# Altium schematic sheet Charger_USB.SchDoc
size A; SheetNumber: 2; SheetTotal: 4
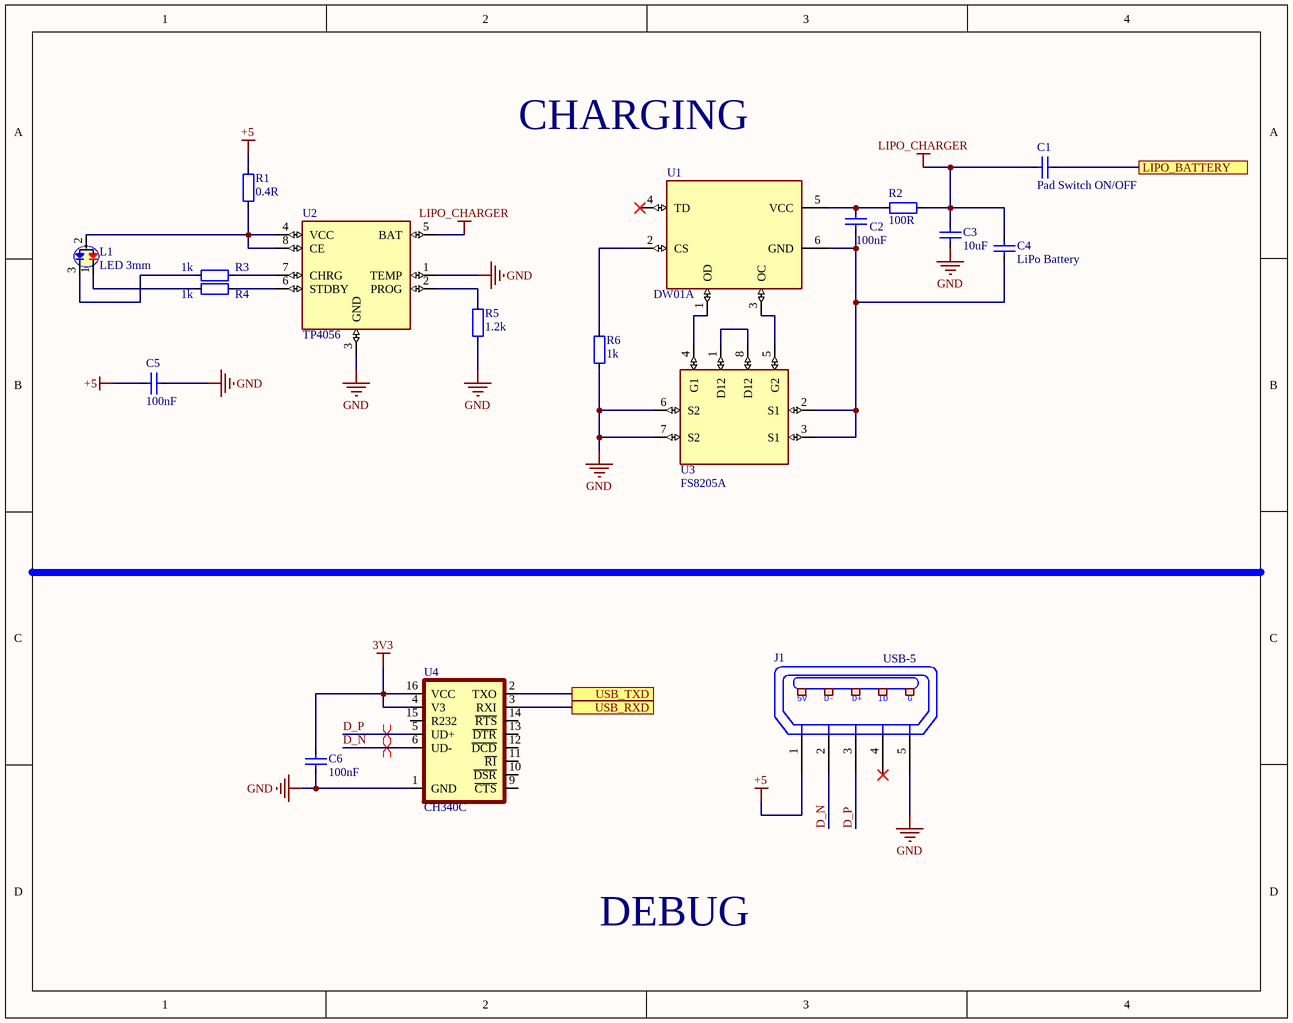
[diagram p0: Charger_USB.SchDoc]

## Parts
C1  Pad Switch ON/OFF  [CAP_3216]
C2  100nF  [CAP_0805]
C3  10uF  [CAP_0805]
C4  LiPo Battery  [CAP_0805]
C5  100nF  [CAP_0805]
C6  100nF  [CAP_0805]
J1  USB-5  [USB-M1]
L1  LED 3mm  [LED-3MM 2 MAU]
R1  0.4R  [RES-SMD-0805]
R2  100R  [RES-SMD-0805]
R3  1k  [RES-SMD-0805]
R4  1k  [RES-SMD-0805]
R5  1.2k  [RES-SMD-0805]
R6  1k  [RES-SMD-0805]
U1  DW01A  [SOT23-6]
U2  TP4056  [TP4056]
U3  FS8205A  [FS8205A]
U4  CH340C  [SO016]

## Ports
LIPO_BATTERY, USB_RXD, USB_TXD

## Nets
3V3: C6.2 U4.4(V3) U4.16(VCC)
+5: C5.2 J1.1(P1) R1.1
GND: C3.2 C5.1 C6.1 J1.5(P5) R5.1 R6.1 U2.1(TEMP) U2.3(GND) U3.6(S2) U3.7(S2) U4.1(GND)
LIPO_CHARGER: C1.1 C3.1 C4.1 R2.2 U2.5(BAT)
D_N: J1.2(P2) U4.6(UD-)
D_P: J1.3(P3) U4.5(UD+)
LIPO_BATTERY: C1.2 ; port LIPO_BATTERY
USB_RXD: U4.3(RXI) ; port USB_RXD
USB_TXD: U4.2(TXO) ; port USB_TXD
NetC2_1: C2.1 R2.1 U1.5(VCC)
NetC2_2: C2.2 C4.2 U1.6(GND) U3.2(S1) U3.3(S1)
NetL1_1: L1.1(Katot_2) R4.2
NetL1_2: L1.2(ANOT) R1.2 U2.4(VCC) U2.8(CE)
NetL1_3: L1.3(Katot_1) R3.2
NetR3_1: R3.1 U2.7(CHRG)
NetR4_1: R4.1 U2.6(STDBY)
NetR5_2: R5.2 U2.2(PROG)
NetR6_2: R6.2 U1.2(CS)
NetU1_1: U1.1(OD) U3.4(G1)
NetU1_3: U1.3(OC) U3.5(G2)
NetU3_1: U3.1(D12) U3.8(D12)

Not connected (* = marked no-connect by the designer): J1 4(P4)*; U1 4(TD)*; U4 9(~{CTS}) 10(~{DSR}) 11(~{RI}) 12(~{DCD}) 13(~{DTR}) 14(~{RTS}) 15(R232)

## Layout directives
differential pair: D_N, D_P

## Notes on the sheet
- CHARGING
- DEBUG
- (in symbol USB-5) 5V; D-; D+; ID; G

## Library data of the parts
C1-C6 = CapSMD: Capacitor; Value: 33p; Published: 8-Jun-2000; LatestRevisionDate: 17-Jul-2002; LatestRevisionNote: Re-released for DXP Platform.; PackageReference: RAD-0.3; Publisher: Altium Limited
J1 = USB-5: Manufacturer: FCI; Manufacturer Part Number: 10118193-0001LF; Connector Type: USB - micro B; Number of Contacts: 5; Gender: Receptacle; Specifications: USB 2.0; .Creator: MM; .Checked PCB: RF; Supplier 1: Digi-Key; RoHS: RoHS Compliant; Category: Connectors, Interconnects; Stock 1: 28642; Pricing 1: 1=0.46, 10=0.433, 25=0.3712, 50=0.3156, 100=0.3032, 250=0.27224, 500=0.25988 (USD); Packaging: Cut Tape (CT); Mounting Type: Surface Mount, Right Angle, Horizontal; Features: Shielded, Solder Retention; Ingress Protection: -; ComponentLink1URL: http://portal.fciconnect.com/Comergent//fci/drawing/10118193.pdf; ComponentLink1Description: http://portal.fciconnect.com/Comergent//fci/drawing/10118193.pdf; Supplier Part Number 1: 609-4616-1-ND; .Checked SCH: MM
L1 = LED 3m 2 mau Anot chung: Cắm; Don_Vi: Con; Ma_Hang: MH005371; Ten_Linh_Kien: Led 3MM 2 Mầu Anot Sáng Đục (5c); Ghi_Chu: *; Kieu_Chan: *; Chung_Loai: Cắm
R1-R6 = Resistor - SMD: Resistor; Manufacturer: Generic Components; Class: Passive; Published: 08/06/2000; Publisher: Altium Hobart Technology Centre
U1 = DW01A: One Cell Lithium-ion/Polymer Battery Protection IC
U2 = TP4056: Complete single cell Li-Ion battery with a constant current / constant voltage linear charger
U4 = CH340C: USB to serial chip CH340; MF: WCH; Package: Package; Check_prices: https://www.snapeda.com/parts/CH340C/WCH/view-part/5428851/?ref=eda; Value: *; Price: None; MP: CH340C; Availability: Unavailable; SnapEDA_Link: https://www.snapeda.com/parts/CH340C/WCH/view-part/5428851/?ref=snap